# EAGLE schematic Hote (EAGLE 9.5.0)
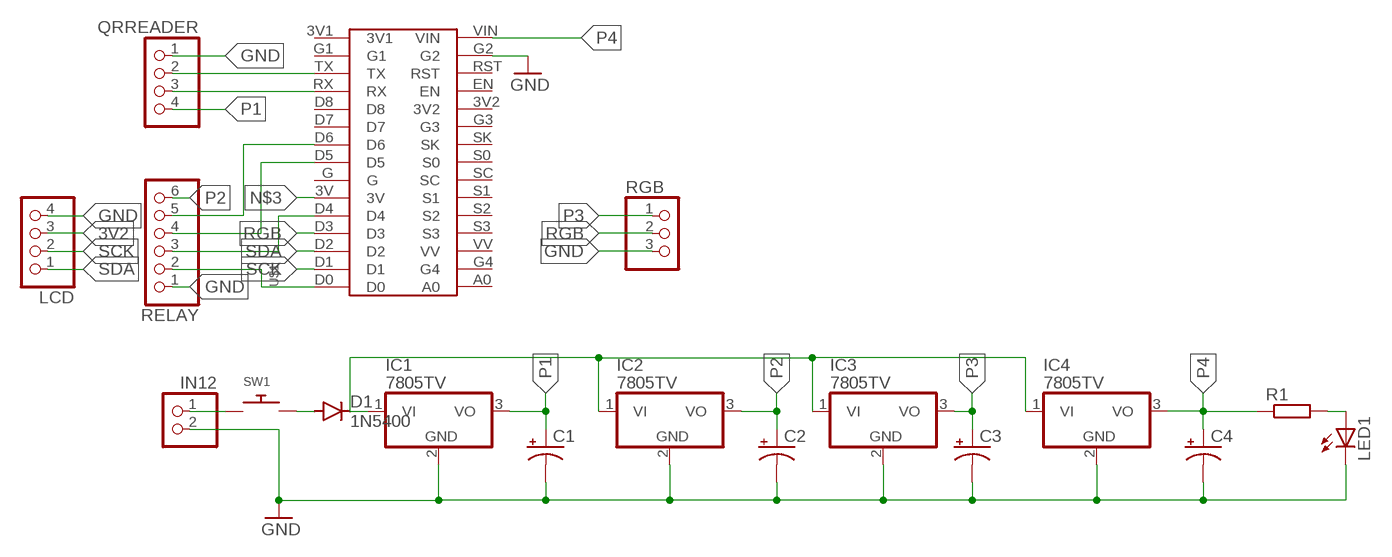
[diagram p0: schematic, sheet 1]

## Parts
C1  CPOL-USTT5D9  [TT5D9]
C2  CPOL-USTT5D9  [TT5D9]
C3  CPOL-USTT5D9  [TT5D9]
C4  CPOL-USTT5D9  [TT5D9]
D1  1N5400  [DO201-15]
IC1  7805TV  [TO220V]
IC2  7805TV  [TO220V]
IC3  7805TV  [TO220V]
IC4  7805TV  [TO220V]
IN12  PINHD-1X2  [1X02]
LCD  PINHD-1X4  [1X04]
LED1  LED5MM  [LED5MM]
QRREADER  PINHD-1X4  [1X04]
R1  R-EU_0204/7  [0204/7]
RELAY  PINHD-1X6  [1X06]
RGB  PINHD-1X3  [1X03]
SW1  SWITCH_PUSHBUTTONEVQ-PE  [TACT_PANA-EVQ]
U$1  LOLIN  [LOLIN]

## Nets
3V2: LCD.3
GND: C1.- C2.- C3.- C4.- IC1.2(GND) IC2.2(GND) IC3.2(GND) IC4.2(GND) IN12.2 LCD.4 LED1.K(C) QRREADER.1 RELAY.1 RGB.3 U$1.G2
N$1: IN12.1 SW1.P$1
N$2: D1.C IC1.1(VI) IC2.1(VI) IC3.1(VI) IC4.1(VI)
N$3: U$1.3V
N$5: QRREADER.2 U$1.TX
N$6: QRREADER.3 U$1.RX
N$7: RELAY.2 U$1.D0
N$8: RELAY.3 U$1.D4
N$9: RELAY.4 U$1.D5
N$10: RELAY.5 U$1.D6
N$11: LED1.A R1.2
N$12: D1.A SW1.P$2
P1: C1.+ IC1.3(VO) QRREADER.4
P2: C2.+ IC2.3(VO) RELAY.6
P3: C3.+ IC3.3(VO) RGB.1
P4: C4.+ IC4.3(VO) R1.1 U$1.VIN
RGB: RGB.2 U$1.D3
SCK: LCD.2 U$1.D1
SDA: LCD.1 U$1.D2
Unconnected: U$1.3V1 U$1.3V2 U$1.A0 U$1.D7 U$1.D8 U$1.EN U$1.G U$1.G1 U$1.G3 U$1.G4 U$1.RST U$1.S0 U$1.S1 U$1.S2 U$1.S3 U$1.SC U$1.SK U$1.VV

## Library data of the parts
C1-C4 = resistor:CPOL-US: POLARIZED CAPACITOR, American symbol
D1 = diode:1N5400: DIODE standard rectifier, 3 A, 50 V (Motorola)
IC1-IC4 = linear:78*: Positive VOLTAGE REGULATOR Source: http://cache.national.com/ds/LM/LM78L05.pdf http://www.fairchildsemi.com/ds/LM/LM7805.pdf
IN12 = pinhead:PINHD-1X2: PIN HEADER
LCD QRREADER = pinhead:PINHD-1X4: PIN HEADER
LED1 = adafruit:LED: LED OSRAM: - CHIPLED LG R971, LG N971, LY N971, LG Q971, LY Q971, LO R971, LY R971 LH N974, LH R974 LS Q976, LO Q976, LY Q976 LO Q996 - Hyper CHIPLED LW Q18S LB Q993, LB Q99A, LB R99A - SideLED LS A670, LO A670, LY A670, LG A670, LP A670 LB A673, LV A673, LT A673, LW A673 LH A674 LY A675 LS A676, LA A676, LO A676, LY A676, LW A676 LS A679, LY A679, LG A679 - Hyper Micro SIDELED® LS Y876, LA Y876, LO Y876, LY Y876 LT Y87S - SmartLED LW L88C, LW L88S LB L89C, LB L89S, LG L890 LS L89K, LO L89K, LY L89K LS L896, LA L896, LO L896, LY L896 - TOPLED LS T670, LO T670, LY T670, LG T670, LP T670 LSG T670, LSP T670, LSY T670, LOP T670, LYG T670 LG T671, LOG T671, LSG T671 LB T673, LV T673, LT T673, LW T673 LH T674 LS T676, LA T676, LO T676, LY T676, LB T676, LH T676, LSB T676, LW T676 LB T67C, LV T67C, LT T67C, LS T67K, LO T67K, LY T67K, LW E67C LS E67B, LA E67B, LO E67B, LY E67B, LB E67C, LV E67C, LT E67C LW T67C LS T679, LY T679, LG T679 LS T770, LO T770, LY T770, LG T770, LP T770 LB T773, LV T773, LT T773, LW T773 LH T774 LS E675, LA E675, LY E675, LS T675 LS T776, LA T776, LO T776, LY T776, LB T776 LHGB T686 LT T68C, LB T68C - Hyper Mini TOPLED® LB M676 - Mini TOPLED Santana® LG M470 LS M47K, LO M47K, LY M47K Source: http://www.osram.convergy.de/
R1 = rcl:R-EU_: RESISTOR, European symbol; SPICEPREFIX: R
RELAY = pinhead:PINHD-1X6: PIN HEADER
RGB = pinhead:PINHD-1X3: PIN HEADER
SW1 = adafruit:SWITCH_PUSHBUTTON: Buttons SOFTTOUCHSMD_SJ - Soft touch temporary push button (Super Junk Akihabara) Compatible with SKPMANE010 [Mouser: 688-SKPMAN] C&K_KSS = Digikey: KSS221GLFS
U$1 = Lolin:LOLIN